# Altium schematic sheet SimpleFlashlight.SchDoc: Flashlight
size A4; Author: VR; CompanyName: VR; DrawnBy: veres; Engineer: veres; Organization: VR; Address1: veres.pcb@gmail.com; DocumentNumber: 001; Revision: 1.0; SheetNumber: 1; SheetTotal: 1; DocumentName: Stepper Motor Driver
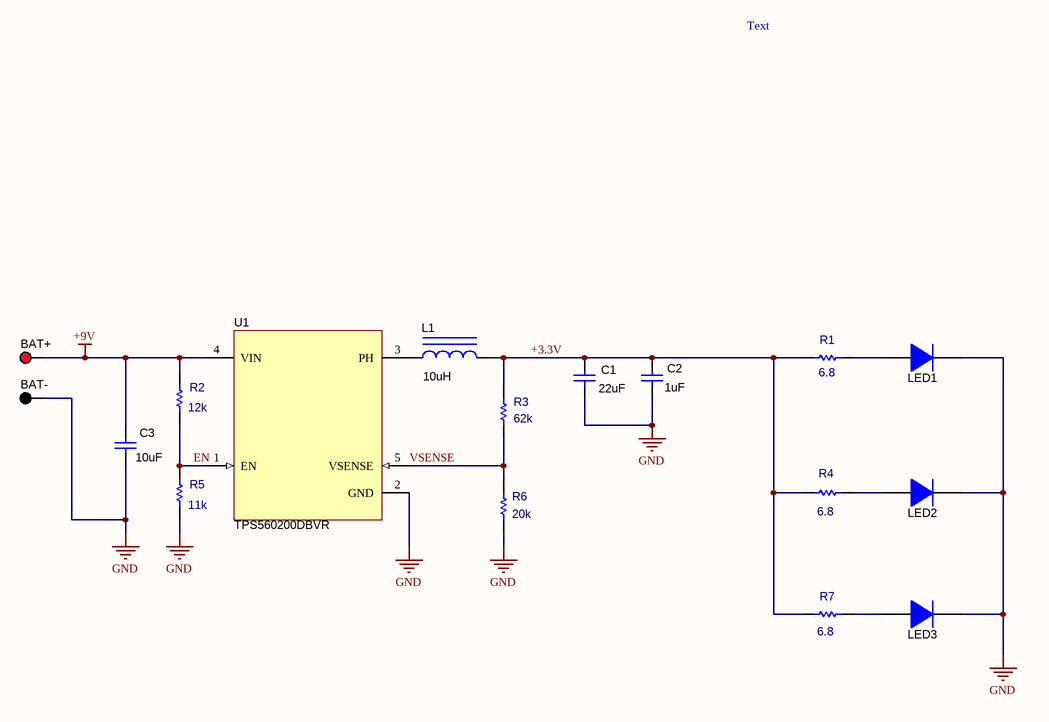
[diagram p0: SimpleFlashlight.SchDoc]

## Parts
BAT+  +  [KEYSTONE5000]  (value not drawn)  (no BOM)
BAT-  -  [KEYSTONE5000]  (value not drawn)  (no BOM)
C1  22uF  [1206]
C2  1uF  [1206]
C3  10uF  [1206]
L1  10uH  [WE-PD_6033]
LED1  4500K  [LED 2835]  (value not drawn)
LED2  4500K  [LED 2835]  (value not drawn)
LED3  4500K  [LED 2835]  (value not drawn)
R1  6.8  [0805_HV]
R2  12k  [0805_HV]
R3  62k  [0805_HV]
R4  6.8  [0805_HV]
R5  11k  [0805_HV]
R6  20k  [0805_HV]
R7  6.8  [0805_HV]
U1  TPS560200DBVR  [DBV0005A_N]

## Nets
+9V: BAT+.1 C3.1 R2.2 U1.4(VIN)
GND: BAT-.1 C1.2 C2.2 C3.2 LED1.2(K) LED2.2(K) LED3.2(K) R5.1 R6.1 U1.2(GND)
+3.3V: C1.1 C2.1 L1.2 R1.1 R3.2 R4.1 R7.1
EN: R2.1 R5.2 U1.1(EN)
VSENSE: R3.1 R6.2 U1.5(VSENSE)
NetL1_1: L1.1 U1.3(PH)
NetLED1_1: LED1.1(A) R1.2
NetLED2_1: LED2.1(A) R4.2
NetLED3_1: LED3.1(A) R7.2

## Notes on the sheet
- Text
- Title
- Size:
- Date:
- A4
- Number:
- Time:
- Revision:
- Sheet
- of
- File:

## Library data of the parts
BAT+ = 5000: Power connection pad; CompType: Test Point Loop; ComponentLink1Description: Datasheet Link; ComponentLink1URL: http://www.keyelco.com/userAssets/file/M60-2p60.pdf; Value: +
BAT- = 5001: Power connection pad; CompType: Test Point Loop; ComponentLink1Description: Datasheet Link; ComponentLink1URL: http://www.keyelco.com/userAssets/file/M60-2p60.pdf; Value: -
C1 = Capacitor: Capacitor ceramic; Manufacturer: MuRata; Manufacturer Part Number: GRM31CR61C226KE15L; Order_Code_ChipIDip: 9000103922; Value: 22uF; ComponentLink1Description: Datasheet link; ComponentLink1URL: http://search.murata.co.jp/Ceramy/PnsearchViewAction.do?HnOFG=ON&HnNFG=ON&SEL_CNT=50&sLang=en&sKey=GRM188R71C105KA12D&x=9&y=9&search=startwith
C2 = Capacitor: Capacitor ceramic; Manufacturer: MuRata; Manufacturer Part Number: GRM188R61A105K; Order_Code_ChipIDip: 886959440; Value: 1uF; ComponentLink1Description: Datasheet link; ComponentLink1URL: http://search.murata.co.jp/Ceramy/PnsearchViewAction.do?HnOFG=ON&HnNFG=ON&SEL_CNT=50&sLang=en&sKey=GRM188R71C105KA12D&x=9&y=9&search=startwith
C3 = Capacitor: Capacitor ceramic; Manufacturer: MuRata; Manufacturer Part Number: GRM21BR71A106KE51L; Order_Code_ChipIDip: 9000122622; Value: 10uF; ComponentLink1Description: Datasheet link; ComponentLink1URL: http://search.murata.co.jp/Ceramy/PnsearchViewAction.do?HnOFG=ON&HnNFG=ON&SEL_CNT=50&sLang=en&sKey=GRM188R71C105KA12D&x=9&y=9&search=startwith
L1 = Inductor: Inductor, Unshielded Drum Core, Metal Composite, SMD; Manufacturer: Bourns; Manufacturer Part Number: SDR0805-100ML; Order_Code_ChipIDip: 246436964; CompType: Inductor; Value: 10uH; ComponentLink1Description: Datasheet link; ComponentLink1URL: http://katalog.we-online.de/kataloge/eisos/media/pdf/744778510.pdf
LED1 = SMD LED: Manufacturer: ENLINCA; Manufacturer Part Number: None; ForvardVoltage: 2.82; CurrentMAX: 0.07; Value: 4500K; Type: SMD LED; ComponentLink1Description: Datasheet link; ComponentLink1URL: http://www.vishay.com/docs/88516/1n5400.pdf; Order_Code_ChipIDip: None; ProductLink: https://aliexpress.ru/item/32975372003.html?spm=a2g39.orderlist.0.0.22a94aa61JPlpc&_ga=2.238780616.970507921.1639827810-654681520.1604340042&_gac=1.162479310.1639346332.Cj0KCQiA2NaNBhDvARIsAEw55hg0RpnmDiEVLwfBwV1DBwQRRzTZISLV43c0hEMg0tSMQHOqo776kiQaArGpEALw_wcB
LED2 LED3 = SMD LED: Manufacturer: ENLINCA; Manufacturer Part Number: None; CurrentMAX: 0.07; ForvardVoltage: 2.82; Value: 4500K; Type: SMD LED; ComponentLink1Description: Datasheet link; ComponentLink1URL: http://www.vishay.com/docs/88516/1n5400.pdf; Order_Code_ChipIDip: None; ProductLink: https://aliexpress.ru/item/32975372003.html?spm=a2g39.orderlist.0.0.22a94aa61JPlpc&_ga=2.238780616.970507921.1639827810-654681520.1604340042&_gac=1.162479310.1639346332.Cj0KCQiA2NaNBhDvARIsAEw55hg0RpnmDiEVLwfBwV1DBwQRRzTZISLV43c0hEMg0tSMQHOqo776kiQaArGpEALw_wcB
R1 R4 R7 = Resistor: Thick Film Chip Resistor; Manufacturer Part Number: RC0805FR-076R8L; Manufacturer: Yageo; Order_Code_ChipIDip: 9000079932; ComponentLink1Description: Manufacturer Link; ComponentLink1URL: http://www.panasonic.com/industrial/components/resistive_products.htm; ComponentLink2Description: Datasheet; ComponentLink2URL: http://www.panasonic.com/industrial/components/pdf/AOA0000CE2.pdf; Value: 6.8
R2 = Resistor: Thick Film Chip Resistor; Manufacturer: Yageo; Manufacturer Part Number: RC0805FR-0712KL; Order_Code_ChipIDip: 9000079516; Value: 12k; ComponentLink1Description: Manufacturer Link; ComponentLink1URL: http://www.panasonic.com/industrial/components/resistive_products.htm; ComponentLink2Description: Datasheet; ComponentLink2URL: http://www.panasonic.com/industrial/components/pdf/AOA0000CE2.pdf
R3 = Resistor: Thick Film Chip Resistor; Manufacturer: Yageo; Manufacturer Part Number: RC0805FR-0762KL; Order_Code_ChipIDip: 9000079533; Value: 62k; ComponentLink1Description: Manufacturer Link; ComponentLink1URL: http://www.panasonic.com/industrial/components/resistive_products.htm; ComponentLink2Description: Datasheet; ComponentLink2URL: http://www.panasonic.com/industrial/components/pdf/AOA0000CE2.pdf
R5 = Resistor: Thick Film Chip Resistor; Manufacturer: Yageo; Manufacturer Part Number: RC0805FR-0711KL; Order_Code_ChipIDip: 9000079515; Value: 11k; ComponentLink1Description: Manufacturer Link; ComponentLink1URL: http://www.panasonic.com/industrial/components/resistive_products.htm; ComponentLink2Description: Datasheet; ComponentLink2URL: http://www.panasonic.com/industrial/components/pdf/AOA0000CE2.pdf
R6 = Resistor: Thick Film Chip Resistor; Manufacturer: Yageo; Manufacturer Part Number: RC0805FR-0720KL; Order_Code_ChipIDip: 9000079521; Value: 20k; ComponentLink1Description: Manufacturer Link; ComponentLink1URL: http://www.panasonic.com/industrial/components/resistive_products.htm; ComponentLink2Description: Datasheet; ComponentLink2URL: http://www.panasonic.com/industrial/components/pdf/AOA0000CE2.pdf
U1 = TPS560200DBVR: 4.5V to 18V Input, 500mA Synchronous Step Down SWIFT Converter with Advanced Eco-mode, DBV0005A; Manufacturer: Texas Instruments; Order_Code_ChipIDip: 9000200421; PackageReference: DBV0005A; ComponentLink1Description: Datasheet Link; ComponentLink1URL: http://www.ti.com/lit/ds/symlink/tps560200.pdf; Manufacturer Part Number: TPS560200DBVR; Value: TPS560200DBVR